# Altium schematic sheet Filter.SchDoc
size Letter; DescLong2_DescShort: -
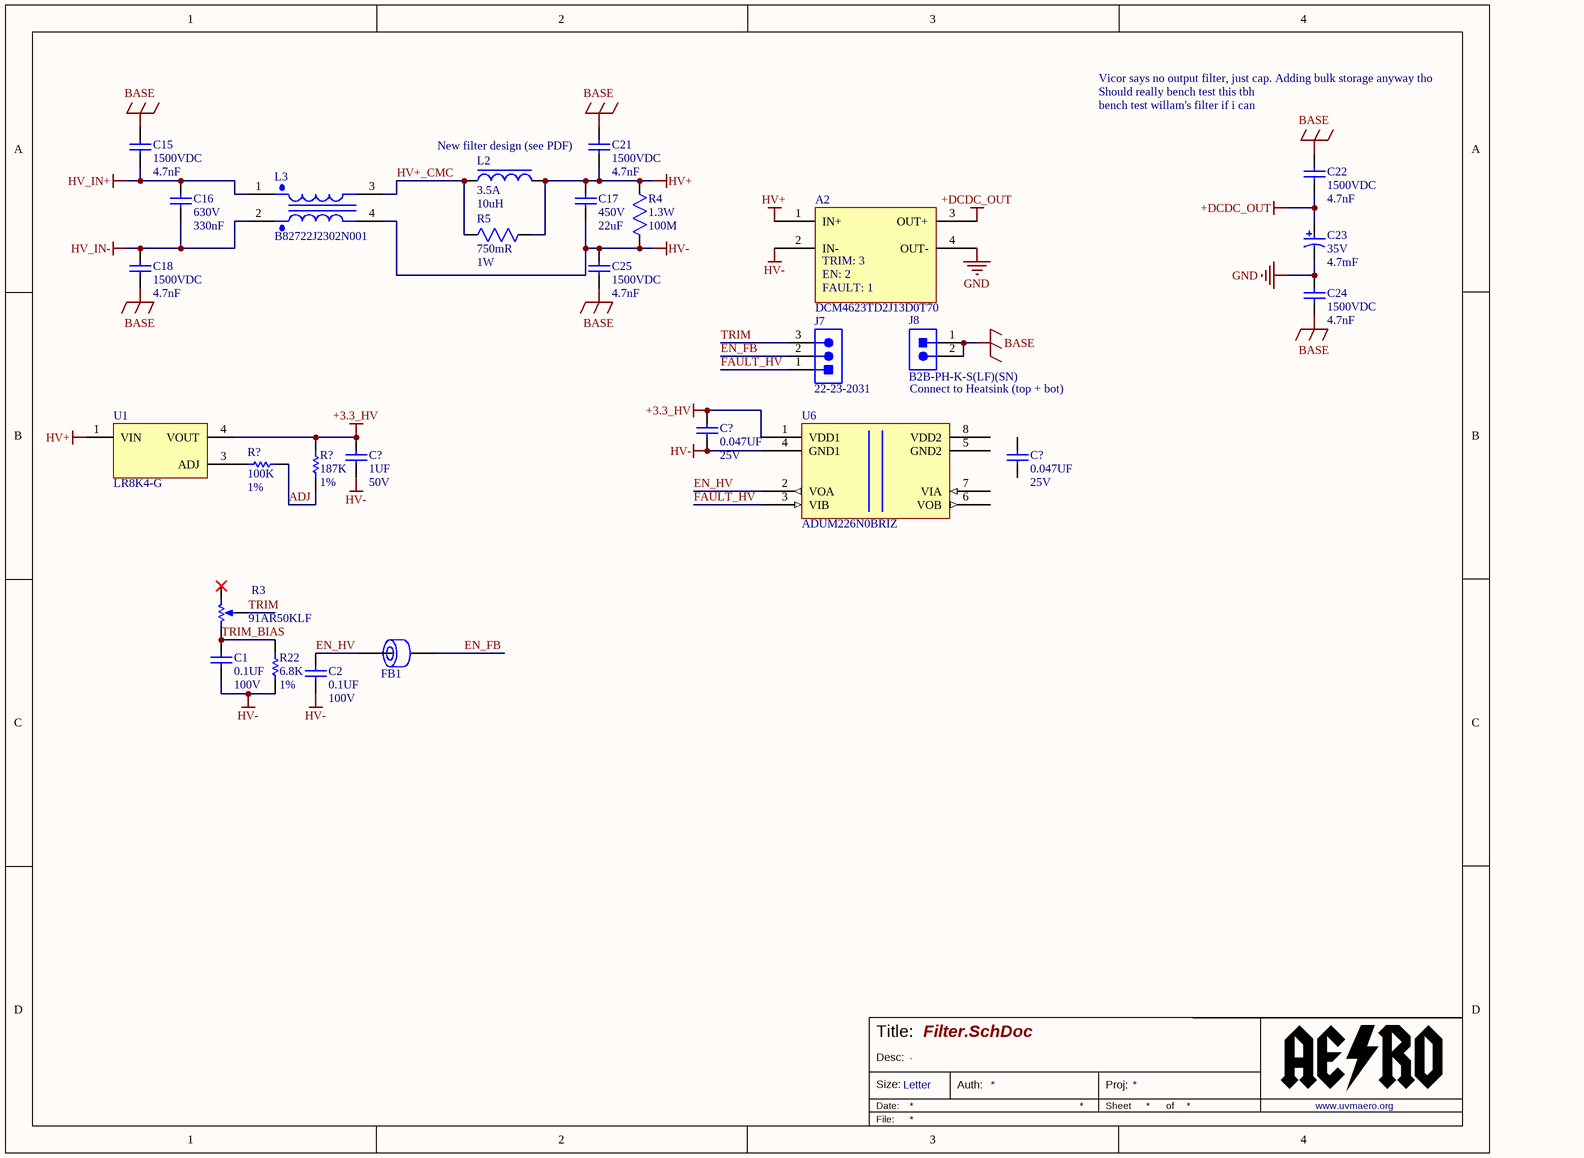
[diagram p0: Filter.SchDoc]

## Parts
(Parts that share a designator on the sheet are numbered #1, #2 ... from top to bottom, then left to right.)
A2  VicorPN: DCM4623TD2J13D0T70  [VICOR_SOCKET_MOD_VERT]  (hidden comment: VicorASM)
C1  Val: 0.1UF  Vol: 100V  [0805_CAP]  (hidden comment: CAP 0805 0.1UF 100V 10% X7R)
C2  Val: 0.1UF  Vol: 100V  [0805_CAP]  (hidden comment: CAP 0805 0.1UF 100V 10% X7R)
C15  Vol: 1500VDC  Val: 4.7nF  [B32021A]  (hidden comment: B32021A3472K289)
C16  Voltage: 630V  Capacitance: 330nF  [B32922C3334M000]  (hidden comment: B32922C3334M000)
C17  Voltage: 450V  Capacitance: 22uF  [B32774D]  (hidden comment: B32774D4226K000)
C18  Vol: 1500VDC  Val: 4.7nF  [B32021A]  (hidden comment: B32021A3472K289)
C21  Vol: 1500VDC  Val: 4.7nF  [B32021A]  (hidden comment: B32021A3472K289)
C22  Vol: 1500VDC  Val: 4.7nF  [B32021A]  (hidden comment: B32021A3472K289)
C23  Voltage: 35V  Capacitance: 4.7mF  [ECA-1VM472]  (hidden comment: ECA-1VM472)
C24  Vol: 1500VDC  Val: 4.7nF  [B32021A]  (hidden comment: B32021A3472K289)
C25  Vol: 1500VDC  Val: 4.7nF  [B32021A]  (hidden comment: B32021A3472K289)
C?#1  Val: 0.047UF  Vol: 25V  [0603_CAP]  (hidden comment: CAP 0603 0.047UF 25V 10% X7R)
C?#2  Val: 1UF  Vol: 50V  [0603_CAP]  (hidden comment: CAP 0603 1UF 50V 10% X7R)
C?#3  Val: 0.047UF  Vol: 25V  [0603_CAP]  (hidden comment: CAP 0603 0.047UF 25V 10% X7R)
FB1  Ferrite Chip 50 Ohms  [1206]  (value not drawn)
J7  22-23-2031  [MOLX-22-23-2031_V]
J8  B2B-PH-K-S(LF)(SN)  [JST_Sales_America_Inc._B2B-PH-K-S_LF_SN_0]
L2  Current Rating: 3.5A  Inductance: 10uH  [WE-HCI-7050]  (hidden comment: 744314101)
L3  B82722J2302N001  [B82722J]
R3  91AR50KLF  [TT_Electronics_91AR50KLF_0]
R4  value 100M  Power: 1.3W  [mur_MHR0422SA107F70]  (hidden comment: MHR0422SA107F70)
R5  Resistance: 750mR  Power Rating: 1W  [RR01_VERT]  (hidden comment: RR01JR75TB)
R22  Val: 6.8K  Tol: 1%  [0805_RES]  (hidden comment: RES 0805 6.8K 1%)
R?#1  Val: 100K  Tol: 1%  [0603_RES]  (hidden comment: RES 0603 100K 1%)
R?#2  Val: 187K  Tol: 1%  [0603_RES]  (hidden comment: RES 0603 187K 1%)
U1  LR8K4-G  [Microchip_C04-189_MFG]
U6  ADUM226N0BRIZ  [ADUM226N0BRIZ]

## Nets
+3.3_HV: C?#1.2 C?#2.2 R?#2.2 U1.4(VOUT) U6.1(VDD1)
+DCDC_OUT: A2.3(OUT+) C22.1 C23.1
BASE: C15.2 C18.1 C21.2 C22.2 C24.1 C25.1 J8.1 J8.2
GND: A2.4(OUT-) C23.2 C24.2
HV+: A2.1(IN+) C17.2 C21.1 L2.2 R4.2 R5.2 U1.1(VIN)
HV-: A2.2(IN-) C1.2 C2.2 C17.1 C25.2 C?#1.1 C?#2.1 L3.4 R4.1 R22.1 U6.4(GND1)
HV_IN+: C15.1 C16.2 L3.1
HV_IN-: C16.1 C18.2 L3.2
ADJ: R?#1.1 R?#2.1
EN_FB: FB1.2 J7.2
EN_HV: C2.1 FB1.1 U6.2(VOA)
FAULT_HV: J7.1 U6.3(VIB)
HV+_CMC: L2.1 L3.3 R5.1
TRIM: J7.3 R3.2(WIPER)
TRIM_BIAS: C1.1 R3.3(CW) R22.2
NetR?#1_2: R?#1.2 U1.3(ADJ)

Not connected (* = marked no-connect by the designer): C?#3 1 2; R3 1(CCW)*; U6 5(GND2) 6(VOB) 7(VIA) 8(VDD2)

## Notes on the sheet
- Vicor says no output filter, just cap. Adding bulk storage anyway tho
- Should really bench test this tbh
- (near C21) New filter design (see PDF)
- bench test willam's filter if i can
- Connect to Heatsink (top + bot)
- Title:
- Size:
- Date:
- Desc:
- Letter
- Auth:
- Sheet
- Proj:
- *
- of
- www.uvmaero.org
- File:
- (in symbol VicorASM_ALT) TRIM: 3; EN: 2; FAULT: 1

## Library data of the parts
A2 = VicorASM_ALT: DCM4623TD2J13D0T70 PCB Assembly; ComponentLink1Description: Datasheet; ComponentLink1URL: http://www.vicorpower.com/documents/datasheets/DCM4623xD2J13D0y7z_ds.pdf
C1 C2 = CAP 0805 0.1UF 100V 10% X7R: Capacitor Surface Mount 0805 Footprint 0.1UF 100V 10% Tolerance Ceramic X7R; Manufacturer: Various; PCB Package: 0805; Description in Visual: Cap SMT 0805 0.1UF 100V 10%  Cer X7R; P/N: CAP 0805 0.1UF 100V 10% X7R; Manufacturer P/N: Various; Value: 0.1UF; Voltage: 100V; Tolerance: 10%; Type: Ceramic X7R; ComponentLink1Description: Manufacturer Website; ComponentLink2Description: Component Datasheet; ComponentLink3Description: Octopart Link
C15 C18 C21 C22 C24 C25 = B32021A3472K289: 4700pF Film Capacitor 300V 1500V (1.5kV) Polypropylene (PP), Metallized Radial; Manufacturer: TDK EPCOS; Lead Diameter: 0.6mm; Tolerance: 10%; Value: 4.7nF; Capacitance: 4.7nF; Case/Package: Radial; Category: Film Capacitors; Depth: 5mm; Dielectric: PP; Dielectric Material: PP; Height - Seated (Max): 0.433inch; Lead Pitch: 10mm; Length: 0.512inch; Manufacturer Part Number: B32021A3472K; Max Operating Temperature: 110°C; Min Operating Temperature: -40°C; Mount: Through Hole; Package Quantity: 1000; Packaging: Bulk; Radiation Hardening: No; Termination: PC Pins; Voltage Rating (AC): 300V; Voltage Rating (DC): 1.5kV; Width: 0.197inch; ComponentLink1Description: Datasheet; ComponentLink1URL: http://en.tdk.eu/inf/20/20/db/fc_2009/Y2_B32021_026.pdf; Voltage: 1500VDC; Supplier 1: Digi-Key; Supplier Part Number 1: 495-4923-1-ND
C16 = B32922C3334M000: 0.33µF Film Capacitor 305V 630V Polypropylene (PP) Radial; Manufacturer: TDK EPCOS; Lead Diameter: 0.8mm; Tolerance: 20%; ComponentLink1Description: Datasheet; ComponentLink1URL: http://en.tdk.eu/inf/20/20/db/fc_2009/Y2_B32021_026.pdf; Supplier 1: Digi-Key; Case/Package: Radial; Category: Film Capacitors; Contact Plating: Tin,Matte; Depth: 8mm; Dielectric: PP; Dielectric Material: Polypropylene; Lead Pitch: 15mm; Length: 18mm; Manufacturer Part Number: B32922C3334M000; Max Operating Temperature: 105°C; Min Operating Temperature: -40°C; Mount: Through Hole; Number of Pins: 2; Packaging: Bulk; Radiation Hardening: No; REACH SVHC: No SVHC; Termination: Radial; Voltage Rating (AC): 305V; Width: 18mm; Supplier Part Number 1: 495-2321-ND
C17 = B32774D4226K000: 22µF Film Capacitor  450V Polypropylene (PP), Metallized Radial; Manufacturer: TDK EPCOS; ESR (Equivalent Series Resistance): 5.4mR; Lead Diameter: 0.8mm; Lead Length: 6mm; Tolerance: 10%; Category: Film Capacitors; Contact Plating: Tin,Matte; Depth: 22mm; Dielectric: PP; Dielectric Material: PP; Height: 36.5mm; Lead Pitch: 27.5mm; Length: 31.5mm; Manufacturer Part Number: B32774D4226K000; Max Operating Temperature: 105°C; Min Operating Temperature: -40°C; Mount: Through Hole; Packaging: Bulk; REACH SVHC: No SVHC; Termination: Radial; Voltage Rating: 450V; Voltage Rating (DC): 450V; Supplier 1: Digi-Key; Supplier Part Number 1: 495-3942-ND
C23 = ECA-1VM472: 4700µF 35V Aluminum Electrolytic Capacitors Radial, Can  2000 Hrs @ 85°C; Manufacturer: Panasonic; Dielectric Material: Aluminium; Dissipation Factor: 0.2%; Lead Diameter: 0.8mm; Lead/Base Style: Straight; Leakage Current: 3uA; Life (Hours): 2000Hour; Polarity: Polar; Ripple Current: 1.6A; Tolerance: 20%; Case/Package: Radial; Category: Aluminum Electrolytic Capacitors; Diameter: 18mm; Height: 35.5mm; Height - Seated (Max): 1.476inch; Lead Free: Lead Free; Lead Pitch: 7.5mm; Length: 35.5mm; Manufacturer Part Number: ECA-1VM472; Max Operating Temperature: 85°C; Min Operating Temperature: -40°C; Mount: Through Hole,PCB; Number of Pins: 2; Package Quantity: 50; Packaging: Bulk; Radiation Hardening: No; REACH SVHC: Yes; Termination: Radial; Voltage Rating: 35V; Voltage Rating (DC): 35V; Supplier 1: Digi-Key; Supplier 2: Digi-Key; Supplier Part Number 1: P5172-ND; Supplier Part Number 2: P5558-ND
C?#1 C?#3 = CAP 0603 0.047UF 25V 10% X7R: Capacitor Surface Mount 0603 Footprint 0.047UF 25V 10% Tolerance Ceramic X7R; Manufacturer: Various; PCB Package: 0603; Description in Visual: Cap SMT 0603 0.047UF 25V 10%  Cer X7R; P/N: CAP 0603 0.047UF 25V 10% X7R; Manufacturer P/N: Various; Value: 0.047UF; Voltage: 25V; Tolerance: 10%; Type: Ceramic X7R; ComponentLink1Description: Manufacturer Website; ComponentLink2Description: Component Datasheet; ComponentLink3Description: Octopart Link
C?#2 = CAP 0603 1UF 50V 10% X7R: Capacitor Surface Mount 0603 Footprint 1UF 50V 10% Tolerance Ceramic X7R; Manufacturer: Various; PCB Package: 0603; Description in Visual: Cap SMT 0603 1UF 50V 10% Ceramic X7R; P/N: CAP 0603 1UF 50V 10% X7R; Manufacturer P/N: Various; Value: 1UF; Voltage: 50V; Tolerance: 10%; Type: Ceramic X7R; ComponentLink1Description: Manufacturer Website; ComponentLink2Description: Component Datasheet; ComponentLink3Description: Octopart Link
FB1 = 742792114: Ferrite Chip 3000 mA 50 Ohms Differential Mode - Single 1206 Footprint; Manufacturer: Wurth Electronics; Description in Visual: Ferrite SMT 3000mA 50Ohm Dif Mode 1206; Usage: Power Supply; Current (mA): 3000; Frequency: 100 MHz; Impedance at Freq (ohms): 50; DC Resistance (ohms): 0.02; P/N: 742792114; Manufacturer P/N: 742792114; Filter type: Differential Mode - Single; Operating Temperature Range: -55 to +125 °C; PCB Package: 1206; ComponentLink1Description: Manufacturer Website; ComponentLink1URL: http://www.we-online.com; ComponentLink2Description: Component Datasheet; ComponentLink2URL: http://www.we-online.com/eisos/pdf/742792114.pdf; ComponentLink3Description: Octopart Link; ComponentLink3URL: http://octopart.com/partsearch/#search/requestData&q=742792114
J7 = 22-23-2031: Male Header, Pitch 2.54 mm, 1 x 3 Position, Height 8.18 mm, Tail Length 3.56 mm, RoHS, Bulk; Current Rating: 4A; Brand: Molex; Pitch: 2.54mm; Voltage Rating: 250V; Mounting Angle: Vertical; Type: Locking; Factory Pack Quantity: 16000; Tradename: KK; Housing Material: Nylon; Contact Material: Brass; Manufacturer URL: http://www.molex.com/; Termination Style: ThroughHole; Mounting Style: ThroughHole; Number of Positions: 3Position; Contact Gender: Pin(Male); Packaging: Bulk; Series: 6373; Datasheet Version: Sep-01; Contact Plating: Tin; Product: Headers; Datasheet URL: https://datasheet.ciiva.com/19472/232274-19472863.pdf; RoHS: Details; Product Category: Headers&WireHousings; Manufacturer: Molex; Number of Rows: 1Row; Supplier 1: Digi-Key; Supplier 2: Digi-Key; Supplier Part Number 2: WM4201-ND; Supplier Part Number 1: WM4201-ND
J8 = B2B-PH-K-S(LF)(SN): Connector Header Through Hole 2 position 0.079" (2.00mm); Manufacturer: JST; Manufacturer Part Number: B2BPHKSLFSN; Connector Type: Male Pin; Contact Resistance: 20mR; Current Rating: 2A; Gender: Male; Insulation Resistance: 1MR; Max Voltage Rating (AC): 100V; Number of Contacts: 2; Pitch: 2mm; Category: Connectors; Color: Natural; Contact Material: Brass,Tin; Contact Mating Length: 0.13inch; Contact Plating: Tin,Copper; Depth: 4.5mm; Fastening Type: Detent; Height: 9.4mm; Housing Color: White; Housing Material: Polyamide; Lead Free: Lead Free; Lead Pitch: 2mm; Length: 5.9mm; Max Current Rating: 2A; Max Operating Temperature: 85°C; Max Voltage Rating (DC): 100V; Min Operating Temperature: -25°C; Mount: Through Hole; Number of Pins: 2; Number of Poles: 2; Number of Positions: 2; Number of Rows: 1; Orientation: Straight; Packaging: Bulk; REACH SVHC: No SVHC; Termination: Solder; Voltage Rating: 100V; Voltage Rating (AC): 100V; Width: 4.5mm; Working Voltage: 100V; Supplier 1: Newark; Supplier 2: Digi-Key; Supplier Part Number 1: 37K9940; Supplier Part Number 2: 455-1704-ND
L2 = 744314101: 10µH Shielded Wirewound Inductor 3.5A 33mOhm Nonstandard; Manufacturer: Wurth Electronics; DC Resistance (DCR): 33mR; Inductance Tolerance: 20%; Saturation Current: 4A; Self Resonant Frequency: 40MHz; Series Resistance: 33R; Test Frequency: 100kHz; Supplier 1: Digi-Key; Supplier Part Number 1: 732-2180-1-ND; Case/Package: 7050; Category: Fixed Inductors; Composition: Wirewound; Depth: 7.2mm; Height: 4.8mm; Height - Seated (Max): 0.197inch; Lead Free: Lead Free; Length: 7mm; Manufacturer Part Number: 744314101; Max DC Current: 3.5A; Max Operating Temperature: 150°C; Military Standard: Not; Min Operating Temperature: -40°C; Mount: Surface Mount; Package Quantity: 1000; Packaging: Tape and Reel; REACH SVHC: Unknown; RMS Current (Irms): 3.5A; Shielding: Shielded; Termination: SMD/SMT; Tolerance: 20%; Width: 6.9mm
L3 = B82722J2302N001: 1.2mH @ 10kHz 2 Line Common Mode Choke Through Hole  3A DCR 56mOhm (Typ); Manufacturer: TDK EPCOS; Approvals: VDE,UR,ENEC; Core Material: Ferrite; DC Resistance (DCR): 56R; Inductance Tolerance: 30%; Lead/Base Style: Pin; Number of Lines: 2; Row Spacing: 12.5mm; Series Resistance: 56mR; Shielding: Unshielded; Voltage Rating (AC): 250V; Case/Package: Radial; Category: Common Mode Chokes; Contact Plating: Tin; Current Rating: 3A; DC Current: 3A; Depth: 16.1mm; Flammability Rating: UL94 V-0; Height: 25.4mm; Inductance: 1.2mH; Lead Free: Lead Free; Lead Pitch: 10mm; Length: 23.3mm; Manufacturer Part Number: B82722J2302N001; Max Current Rating: 3A; Max DC Current: 3A; Max Operating Temperature: 125°C; Military Standard: Not; Min Operating Temperature: -40°C; Mount: Through Hole; Number of Pins: 4; Package Quantity: 540; Packaging: Box; Radiation Hardening: No; REACH SVHC: No SVHC; Termination: Radial; Test Frequency: 10kHz; Tolerance: 30%; Weight: 0.35274oz; Width: 16.1mm; Supplier 1: Digi-Key; Supplier Part Number 1: 495-2748-ND
R3 = 91AR50KLF: 50 kOhms 0.5W, 1/2W Through Hole Thumbwheel Potentiometer Top Adjustment; Manufacturer: TT BI; Max Power Dissipation: 500mW; Number of Turns: 1; Resistance: 50kR; Temperature Coefficient: 100ppm/°C; Tolerance: 20%; Category: Variable Resistors and Potentiometers; Composition: Cermet; Depth: 9.78mm; Height: 0.2inch; Lead Free: Lead Free; Length: 9.53mm; Manufacturer Part Number: 91AR50KLF; Max Operating Temperature: 125°C; Military Standard: Not; Min Operating Temperature: -55°C; Mount: Through Hole; Package Quantity: 100; Packaging: Bulk; Power Rating: 500mW; REACH SVHC: No SVHC; Taper: Linear; Termination: Pin; Type: Potentiometer; Weight: 0.85g; Supplier 1: Digi-Key; Supplier Part Number 1: 987-1625-ND
R4 = MHR0422SA107F70: 100 MOhms ±1% 1.3W Through Hole Resistor Radial High Voltage Thick Film; Manufacturer: Murata; Manufacturer Part Number: MHR0422SA107F70; Supplier 1: Digi-Key; Supplier Part Number 1: 490-18226-ND
R5 = RR01JR75TB: 750 mOhms ±5% 1W Through Hole Resistor Axial Flame Retardant Coating, Pulse Withstanding, Safety Metal Film; Manufacturer: TE Connectivity Holsworthy; Voltage Rating: 350V; Number of Resistors: 1; Temperature Coefficient: 300ppm/°C; Case/Package: Axial; Category: Through-Hole Resistors; Composition: Power resistor; Diameter: 2.6mm; ELV: Compliant; Length: 6.8mm; Manufacturer Part Number: RR01JR75TB; Max Operating Temperature: 155°C; Min Operating Temperature: -55°C; Mount: Axial; Number of Terminations: 2; Package Quantity: 5000; Packaging: Ammo Pack; Termination: Axial; Tolerance: 5%; Supplier 1: Digi-Key; Supplier Part Number 1: A138247CT-ND
R22 = RES 0805 6.8K 1%: Resistor Surface Mount, 6.8K Ohms, 0805 Footprint, 1% Tolerance 0.125W; Manufacturer: Various; PCB Package: 0805; Description in Visual: Res SMT 6.8K 0805  1%  0.125W; P/N: RES 0805 6.8K 1%; Manufacturer P/N: Various; Value: 6.8K; Power_Rating: 0.125W; Tolerance: 1%
R?#1 = RES 0603 100K 1%: Resistor Surface Mount, 100K Ohms, 0603 Footprint, 1% Tolerance 0.1W; Manufacturer: Various; PCB Package: 0603; Description in Visual: Res SMT 100K 0603  1%  0.1W; P/N: RES 0603 100K 1%; Manufacturer P/N: Various; Value: 100K; Power_Rating: 0.1W; Tolerance: 1%
R?#2 = RES 0603 187K 1%: Resistor Surface Mount, 187K Ohms, 0603 Footprint, 1% Tolerance 0.1W; Manufacturer: Various; PCB Package: 0603; Description in Visual: Res SMT 187K 0603  1%  0.1W; P/N: RES 0603 187K 1%; Manufacturer P/N: Various; Value: 187K; Power_Rating: 0.1W; Tolerance: 1%
U1 = LR8K4-G: Linear Voltage Regulator IC Positive Adjustable 1 Output  10mA TO-252, (D-Pak); Supplier 1: Digi-Key; Supplier Part Number 1: LR8K4-GCT-ND
U6 = ADUM226N0BRIZ: General Purpose Digital Isolator 5000Vrms 2 Channel 150Mbps 75kV/µs CMTI 8-SOIC (0.295", 7.50mm Width); Manufacturer: Analog Devices; Vendor: Analog Devices Inc; Built_By: Analog Devices Inc.; Max Supply Voltage: 5.5V; Min Supply Voltage: 1.7V; Number of Channels: 2; Propagation Delay: 7.2ns; Manufacturer_Part_Number: ADUM226N0BRIZ; Copyright: Copyright (C) 2018 Accelerated Designs. All rights reserved; RefDes: RefDes; Type: DEV; Value: Value; Case/Package: SOIC; Lead Free: Contains Lead; Manufacturer Part Number: ADUM226N0BRIZ; Max Operating Temperature: 125°C; Min Operating Temperature: -40°C; Number of Pins: 8; REACH SVHC: No SVHC